# EAGLE design TCAN337 Breakout Board (EAGLE 9.6.2)
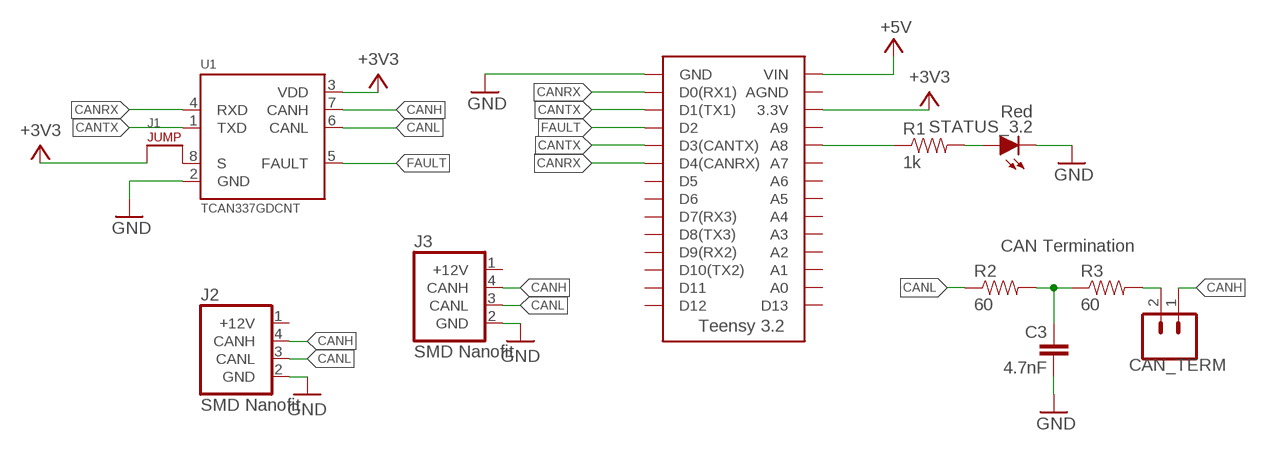
[diagram p0: schematic, sheet 1]

## Parts
3.2  TEENSY_3.2_SIMPLE  [TEENSY_3.2_SIMPLE]
C3  4.7nF  CAP0603-CAP  [0603-CAP]
CAN_TERM  M02_SLIM  [1X02_SLIM]
J1  JUMPER.1  [1X02]
J2  CONNECTOR-CAN  [MOLEX_NANOFIT_SMD_04]
J3  CONNECTOR-CAN  [MOLEX_NANOFIT_SMD_04]
R1  1k  RESISTOR0603-RES  [0603-RES]
R2  60  RESISTOR0603-RES  [0603-RES]
R3  60  RESISTOR0603-RES  [0603-RES]
STATUS_3.2  Red  LED-0603  [LED-603]
U1  CAN_TRANSCIEVER_TCAN337TCAN337SOT-23-8  [SOT-23-8]

## Nets
+3V3: 3.2.3.3V J1.1 U1.3(VDD)
+5V: 3.2.VIN
CANH: CAN_TERM.1 J2.4(CANH) J3.4(CANH) U1.7(CANH)
CANL: J2.3(CANL) J3.3(CANL) R2.1 U1.6(CANL)
CANRX: 3.2.D0(RX1) 3.2.D4(CANRX) U1.4(RXD)
CANTX: 3.2.D1(TX1) 3.2.D3(CANTX) U1.1(TXD)
FAULT: 3.2.D2 U1.5(FAULT)
GND: 3.2.GND C3.2 J2.2(GND) J3.2(GND) STATUS_3.2.C U1.2(GND)
N$1: J1.2 U1.8(S)
N$2: C3.1 R2.2 R3.1
N$3: 3.2.A8 R1.1
N$4: R1.2 STATUS_3.2.A
N$5: CAN_TERM.2 R3.2
Unconnected: 3.2.A0 3.2.A1 3.2.A2 3.2.A3 3.2.A4 3.2.A5 3.2.A6 3.2.A7 3.2.A9 3.2.AGND 3.2.D5 3.2.D6 3.2.D7(RX3) 3.2.D8(TX3) 3.2.D9(RX2) 3.2.D10(TX2) 3.2.D11 3.2.D12 3.2.D13

## Notes on the sheet
- CAN Termination

## Power pins joined to a net without a drawn wire
+12V: J2.1(+12V) J3.1(+12V)

## Library data of the parts
3.2 = HyTechDevices:TEENSY_3.2_SIMPLE: Simple version of the Teensy 3.2 board that only uses the 2 main rows of pins, not the inner pins or the pins opposite the usb port.
C3 = HyTechDevices:CAP: Capacitor Standard 0603 ceramic capacitor, and 0.1" leaded capacitor.
CAN_TERM = HyTechDevices:M02: Standard 2-pin 0.1" header. NOTES ON THE VARIANTS LOCK and LOCK_LONGPADS... This footprint was designed to help hold the alignment of a through-hole component (i.e. 6-pin header) while soldering it into place. You may notice that each hole has been shifted either up or down by 0.005 of an inch from it's more standard position (which is a perfectly straight line). This slight alteration caused the pins (the squares in the middle) to touch the edges of the holes. Because they are alternating, it causes a "brace" to hold the component in place. 0.005 has proven to be the perfect amount of "off-center" position when using our standard breakaway headers. Although looks a little odd when you look at the bare footprint, once you have a header in there, the alteration is very hard to notice. Also,if you push a header all the way into place, it is covered up entirely on the bottom side. This idea of altering the position of holes to aid alignment will be further integrated into the Sparkfun Library for other footprints. It can help hold any component with 3 or more connection pins. Note: The Sparkfun version includes many other packages including surface mount that may be of future interest. Source: Sparkfun <https://github.com/sparkfun/SparkFun-Eagle-Libraries>
J1 = HyTechDevices:JUMPER: Jumper for changing operation of a device
J2 J3 = HyTechDevices:CONNECTOR-CAN; MODEL: SMD Nanofit
R1-R3 = HyTechDevices:RESISTOR: Resistor Basic schematic elements and footprints for 0603, 1206, and PTH resistors.
STATUS_3.2 = HyTechDevices:LED: Light Emitting Diode (LED) Source: Dangerous Prototypes Eagle Library <https://github.com/DangerousPrototypes/Eagle_Part_Library>
U1 = HyTechDevices:CAN_TRANSCIEVER_TCAN337: TCAN337 Can Tranciever Datasheet <https://www.ti.com/lit/ds/symlink/tcan337.pdf?ts=1610765239354&ref_url=https%253A%252F%252Fwww.ti.com%252Fproduct%252FTCAN337>; DKPN: 296-44539-1-ND; MANUFACTURER: Texas Instruments; MOPN: 595-TCAN337GDCNT; MPN: TCAN337GDCNT

## Board
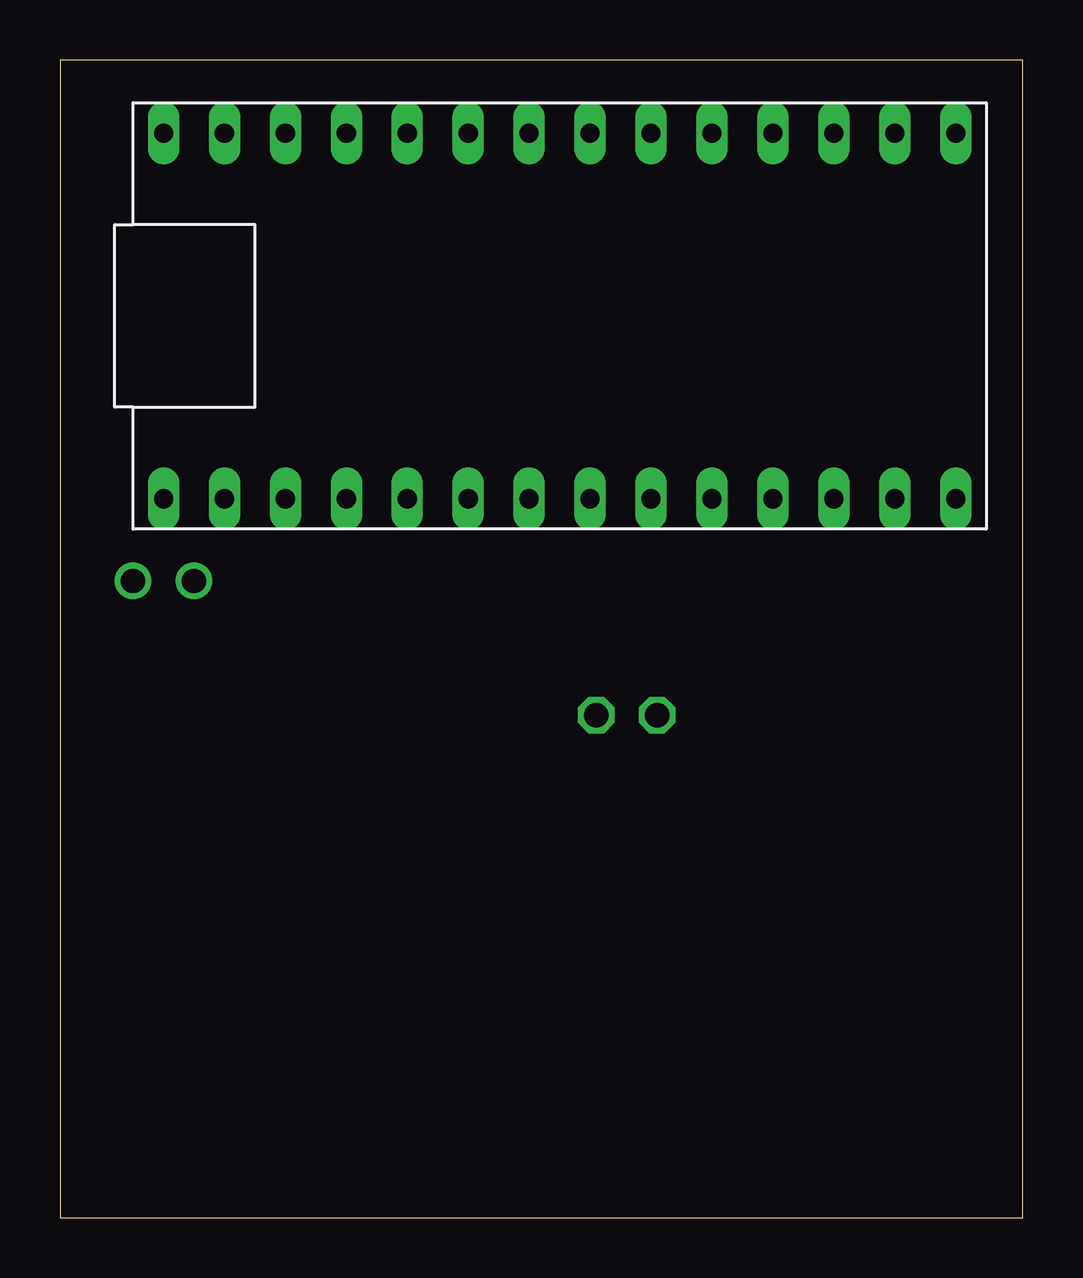
[diagram p1: board, top side]
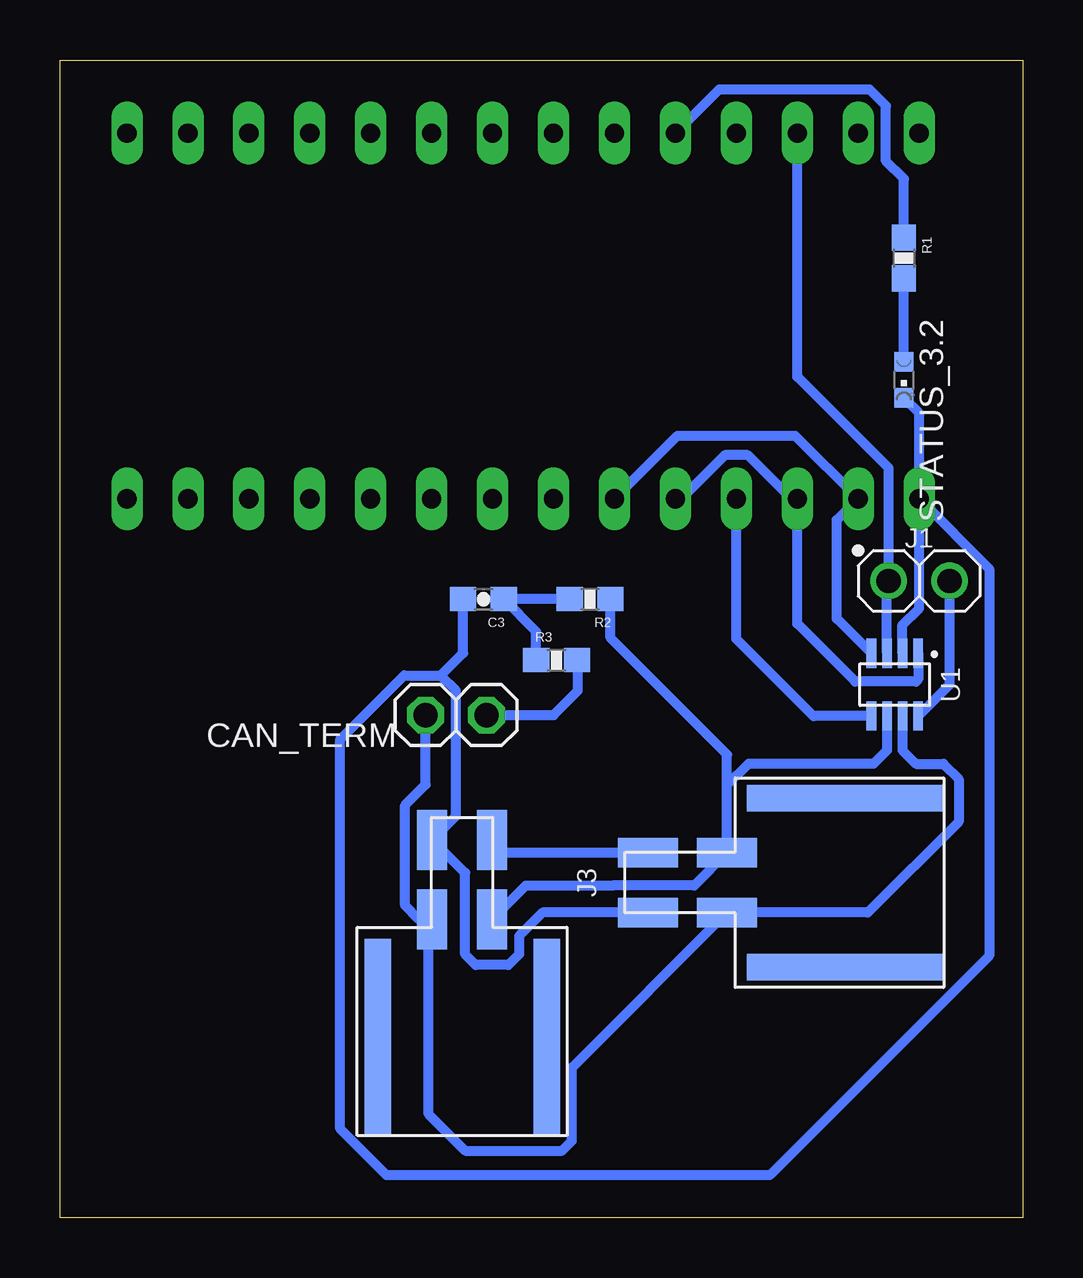
[diagram p2: board, bottom side, seen from below]

Size 40.13 x 48.26 mm. Coordinates in mm from the lower left corner, seen from the top.
Outline: 0,0 40.13,0 40.13,48.26 0,48.26 0,0
Copper layers (1*16): Top 0.035mm / dielectric 1.5mm / Bottom 0.035mm
Design rules "On Campus (2 Layer)": minimum track width 16mil, minimum drill 0.8mm, track to track 16mil, track to pad 12mil, pad to pad 16mil, via to via 16mil, smd to smd 10mil, copper to edge 40mil, drill to drill 10mil, minimum pad ring 10mil, minimum via ring 8mil, stop-mask expansion 4mil, vias tented up to drill 0mil, thermal gap 10mil

### Footprints (pad centres in the part's own frame; a part is rotated, then mirrored left to right if it is on the bottom)
TEENSY_3.2_SIMPLE = drill 0.8 long: 3.3V 16.51,29.21; A0 16.51,3.81; A1 16.51,6.35; A2 16.51,8.89; A3 16.51,11.43; A4 16.51,13.97; A5 16.51,16.51; A6 16.51,19.05; A7 16.51,21.59; A8 16.51,24.13; A9 16.51,26.67; AGND 16.51,31.75; D0(RX1) 1.27,31.75; D1(TX1) 1.27,29.21; D2 1.27,26.67; D3(CANTX) 1.27,24.13; D4(CANRX) 1.27,21.59; D5 1.27,19.05; D6 1.27,16.51; D7(RX3) 1.27,13.97; D8(TX3) 1.27,11.43; D9(RX2) 1.27,8.89; D10(TX2) 1.27,6.35; D11 1.27,3.81; D12 1.27,1.27; D13 16.51,1.27; GND 1.27,34.29; VIN 16.51,34.29
0603-CAP = smd 1.1 x 1: 1 -0.85,0; 2 0.85,0
1X02_SLIM = drill 1.016 octagon: 1 -1.27,0; 2 1.27,0
1X02 = drill 1.016: 1 -1.27,0; 2 1.27,0
MOLEX_NANOFIT_SMD_04 = smd 1.24 x 2.5: 1 1.25,1.65; 2 -1.25,1.65; 3 1.25,-1.65; 4 -1.25,-1.65 | smd 1.1 x 8.2: PAD1 -3.52,-6.58; PAD@1 3.52,-6.58
0603-RES = smd 1.1 x 1: 1 -0.85,0; 2 0.85,0
LED-603 = smd 0.8 x 0.8: A 0,-0.75; C 0,0.75
SOT-23-8 = smd 0.4 x 1.22: 1 -0.975,-1.31; 2 -0.325,-1.31; 3 0.325,-1.31; 4 0.975,-1.31; 5 0.975,1.31; 6 0.325,1.31; 7 -0.325,1.31; 8 -0.975,1.31

### Placement (x,y rotation side)
3.2  38.61,28.7 90 top
C3  22.48,25.78 180 bottom
CAN_TERM  23.62,20.95 0 bottom
J1  4.32,26.54 0 bottom
J2  23.37,14.1 0 bottom
J3  13.97,13.97 90 bottom
R1  4.95,40 270 bottom
R2  18.03,25.78 180 bottom
R3  19.43,23.24 0 bottom
STATUS_3.2  4.95,34.92 180 bottom
U1  5.33,22.22 180 bottom

### Tracks (layer width: path | path; a pad name or v marks a point on that pad's centre or on a via)
+3V3
  Bottom 0.406: 3.2.3.3V 9.4,35.05 5.59,31.24 J1.1 5.66,26.47 U1.3
+12V
  Bottom 0.406: J2.1 21.59,15.22 J3.1
CANH
  Bottom 0.406: U1.7 5.01,19.49 4.45,18.92 3.3,18.92 2.67,18.29 2.67,16.51 6.46,12.72 J3.4 18.79,6.25 18.79,3.21 19.2,2.79 23.24,2.79 24.77,4.32 24.77,12.3 J2.4 25.18,12.45 25.75,13.02 25.75,17.21 24.89,18.06 CAN_TERM.1
CANL
  Bottom 0.406: U1.6 5.66,19.49 6.22,18.92 11.43,18.92 12.32,18.03 | 12.32,18.03 J3.3 13.69,13.85 17.08,13.85 17.09,13.84 20.72,13.84 J2.3 | 12.32,18.03 12.32,19.3 17.18,24.17 R2.1
CANRX
  Bottom 0.406: 3.2.D4(CANRX) 14.39,32.6 9.49,32.6 3.2.D0(RX1) 7.75,29.08 7.75,24.97 U1.4
CANTX
  Bottom 0.406: U1.1 4.36,22.44 4.45,22.35 6.98,22.35 9.4,24.77 3.2.D1(TX1) 9.64,29.97 11.46,31.79 12.42,31.79 14.24,29.97 3.2.D3(CANTX)
FAULT
  Bottom 0.406: U1.5 8.72,20.91 11.94,24.13 3.2.D2
GND
  Bottom 0.406: U1.2 5.01,24.71 4.32,25.4 3.2.GND | 3.2.GND 4.32,33.54 STATUS_3.2.C | 3.2.GND 1.4,27.05 1.4,10.92 10.54,1.78 26.52,1.78 28.45,3.71 28.45,19.94 25.78,22.61 24.26,22.61 | 24.26,22.61 23.62,21.97 23.62,16.74 J2.2 23.25,14.38 23.25,10.99 22.8,10.54 21.44,10.54 20.99,10.99 20.99,11.74 20.01,12.72 J3.2 | 24.26,22.61 23.33,23.53 C3.2
N$1
  Bottom 0.406: U1.8 3.05,22.23 J1.2
N$2
  Bottom 0.406: R3.1 20.28,24.43 C3.1 R2.2
N$3
  Bottom 0.406: R1.1 4.95,43.31 5.7,44.05 5.7,46.35 6.38,47.03 12.66,47.03 3.2.A8
N$4
  Bottom 0.406: STATUS_3.2.A R1.2
N$5
  Bottom 0.406: CAN_TERM.2 19.56,20.95 18.54,21.97 18.54,23.2 R3.2